# EAGLE design main (EAGLE 5.11)
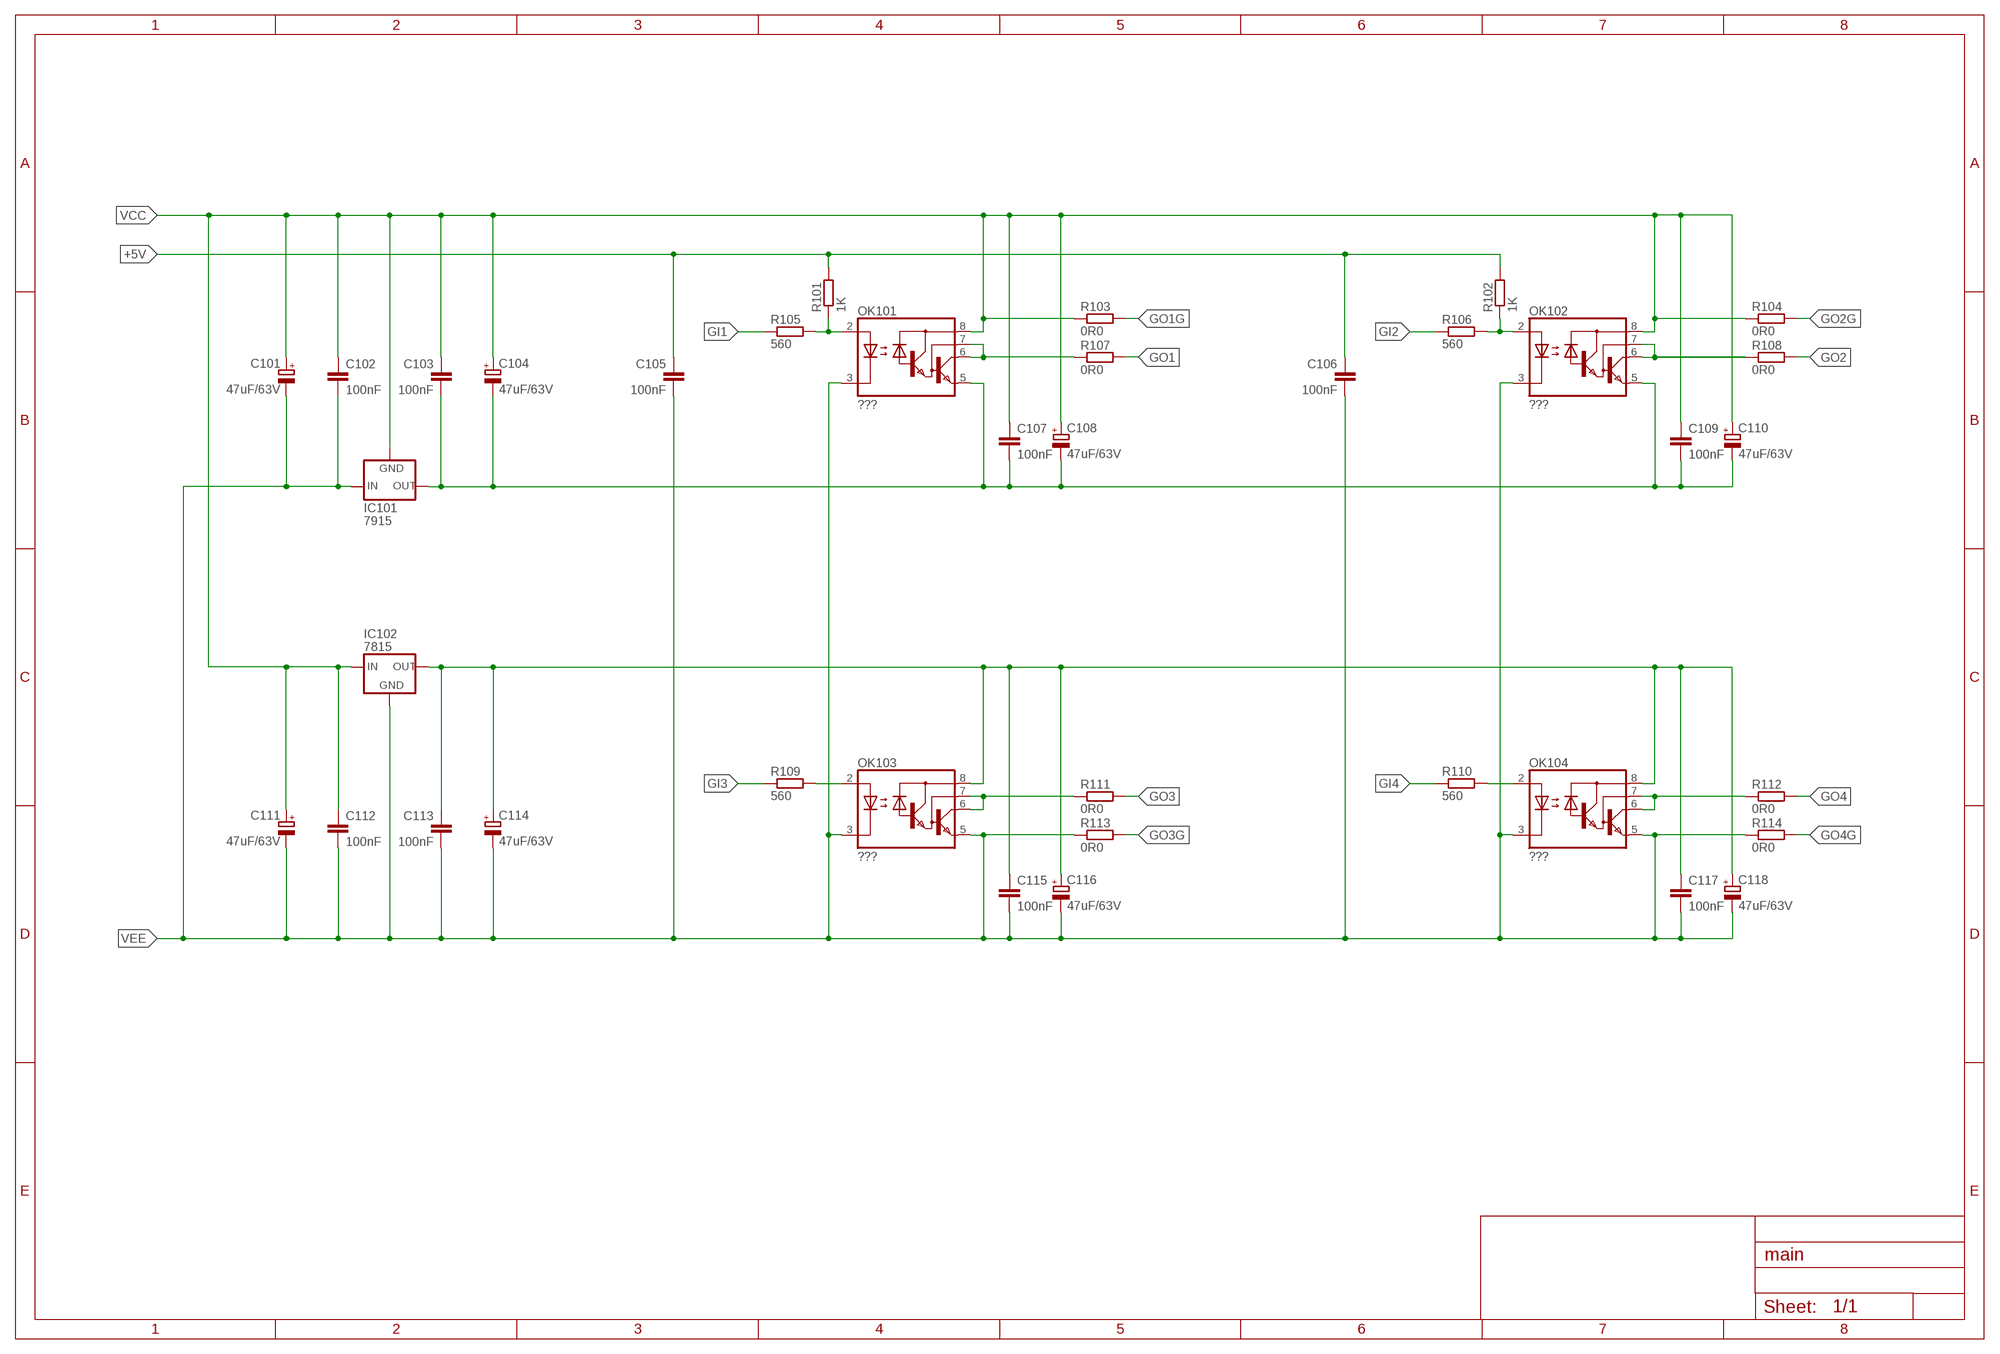
[diagram p0: schematic, sheet 1]

## Parts
C101  47uF/63V  CPOL-EUE2.5-5  [E2,5-5]
C102  100nF  C-EU050-025X075  [C050-025X075]
C103  100nF  C-EU050-025X075  [C050-025X075]
C104  47uF/63V  CPOL-EUE2.5-5  [E2,5-5]
C105  100nF  C-EU025-024X044  [C025-024X044]
C106  100nF  C-EU025-024X044  [C025-024X044]
C107  100nF  C-EU050-025X075  [C050-025X075]
C108  47uF/63V  CPOL-EUE2.5-5  [E2,5-5]
C109  100nF  C-EU050-025X075  [C050-025X075]
C110  47uF/63V  CPOL-EUE2.5-5  [E2,5-5]
C111  47uF/63V  CPOL-EUE2.5-5  [E2,5-5]
C112  100nF  C-EU050-025X075  [C050-025X075]
C113  100nF  C-EU050-025X075  [C050-025X075]
C114  47uF/63V  CPOL-EUE2.5-5  [E2,5-5]
C115  100nF  C-EU050-025X075  [C050-025X075]
C116  47uF/63V  CPOL-EUE2.5-5  [E2,5-5]
C117  100nF  C-EU050-025X075  [C050-025X075]
C118  47uF/63V  CPOL-EUE2.5-5  [E2,5-5]
IC101  7915  79XXS  [79XXS]
IC102  7815  78XXS  [78XXS]
OK101  ???  6N138  [DIL08]
OK102  ???  6N138  [DIL08]
OK103  ???  6N138  [DIL08]
OK104  ???  6N138  [DIL08]
R101  1K  R-EU_0207/7  [0207/7]
R102  1K  R-EU_0207/7  [0207/7]
R103  0R0  R-EU_0207/7  [0207/7]
R104  0R0  R-EU_0207/7  [0207/7]
R105  560  R-EU_0207/7  [0207/7]
R106  560  R-EU_0207/7  [0207/7]
R107  0R0  R-EU_0207/7  [0207/7]
R108  0R0  R-EU_0207/7  [0207/7]
R109  560  R-EU_0207/7  [0207/7]
R110  560  R-EU_0207/7  [0207/7]
R111  0R0  R-EU_0207/7  [0207/7]
R112  0R0  R-EU_0207/7  [0207/7]
R113  0R0  R-EU_0207/7  [0207/7]
R114  0R0  R-EU_0207/7  [0207/7]

## Nets
+5V: C105.1 C106.1 R101.2 R102.2
GI1: R105.1
GI2: R106.1
GI3: R109.1
GI4: R110.1
GO1: R107.2
GO1G: R103.2
GO2: R108.2
GO2G: R104.2
GO3: R111.2
GO3G: R113.2
GO4: R112.2
GO4G: R114.2
N$1: OK103.6(VO) OK103.7(VB) R111.1
N$2: OK104.2(A) R110.2
N$3: OK103.2(A) R109.2
N$4: C113.1 C114.+ C115.1 C116.+ C117.1 C118.+ IC102.OUT OK103.8(VCC) OK104.8(VCC)
N$5: OK101.2(A) R101.1 R105.2
N$6: C103.2 C104.- C107.2 C108.- C109.2 C110.- IC101.OUT OK101.5(GND) OK102.5(GND)
N$8: OK102.6(VO) OK102.7(VB) R108.1
N$13: OK104.6(VO) OK104.7(VB) R112.1
N$15: OK102.2(A) R102.1 R106.2
N$17: OK101.6(VO) OK101.7(VB) R107.1
VCC: C101.+ C102.1 C103.1 C104.+ C107.1 C108.+ C109.1 C110.+ C111.+ C112.1 IC101.GND IC102.IN OK101.8(VCC) OK102.8(VCC) R103.1 R104.1
VEE: C101.- C102.2 C105.2 C106.2 C111.- C112.2 C113.2 C114.- C115.2 C116.- C117.2 C118.- IC101.IN IC102.GND OK101.3(C) OK102.3(C) OK103.3(C) OK103.5(GND) OK104.3(C) OK104.5(GND) R113.1 R114.1

## Library data of the parts
C101 C104 C108 C110 C111 C114 C116 C118 = rcl:CPOL-EU: POLARIZED CAPACITOR, European symbol
C102 C103 C105-C107 C109 C112 C113 C115 C117 = rcl:C-EU: CAPACITOR, European symbol
IC101 = v-reg:79XXS: VOLTAGE REGULATOR
IC102 = v-reg:78XXS: VOLTAGE REGULATOR
OK101-OK104 = optocoupler:6N138: MOTOROLA OPTO COUPLER; MF: VISHAY/TELEFUNKEN; MPN: 6N138; OC_FARNELL: 9860150; OC_NEWARK: 35K5294
R101-R114 = rcl:R-EU_: RESISTOR, European symbol

## Board
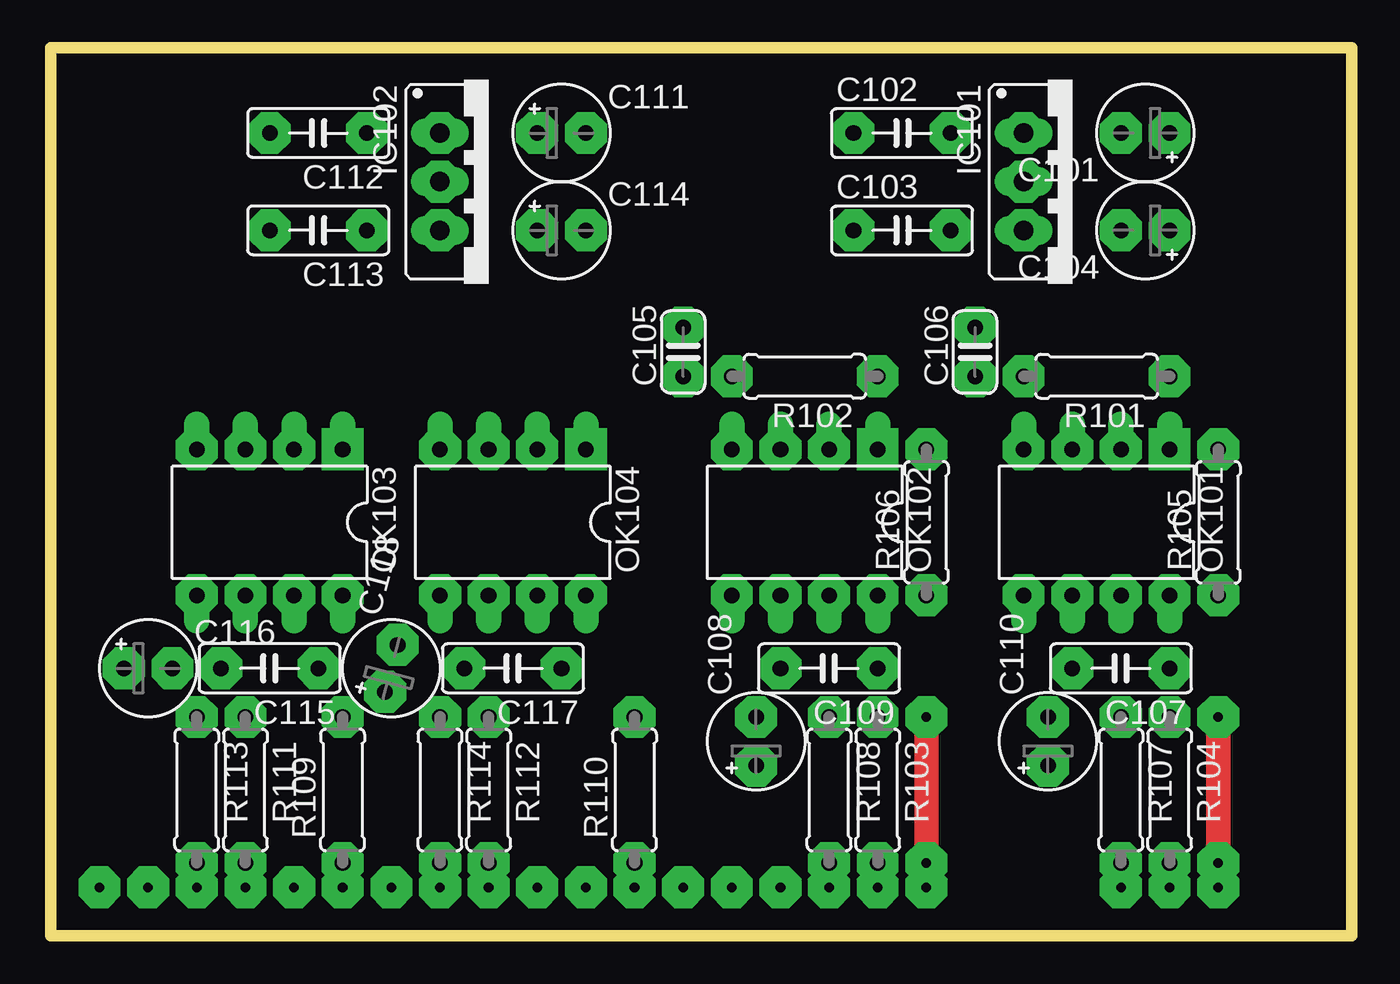
[diagram p1: board, top side]
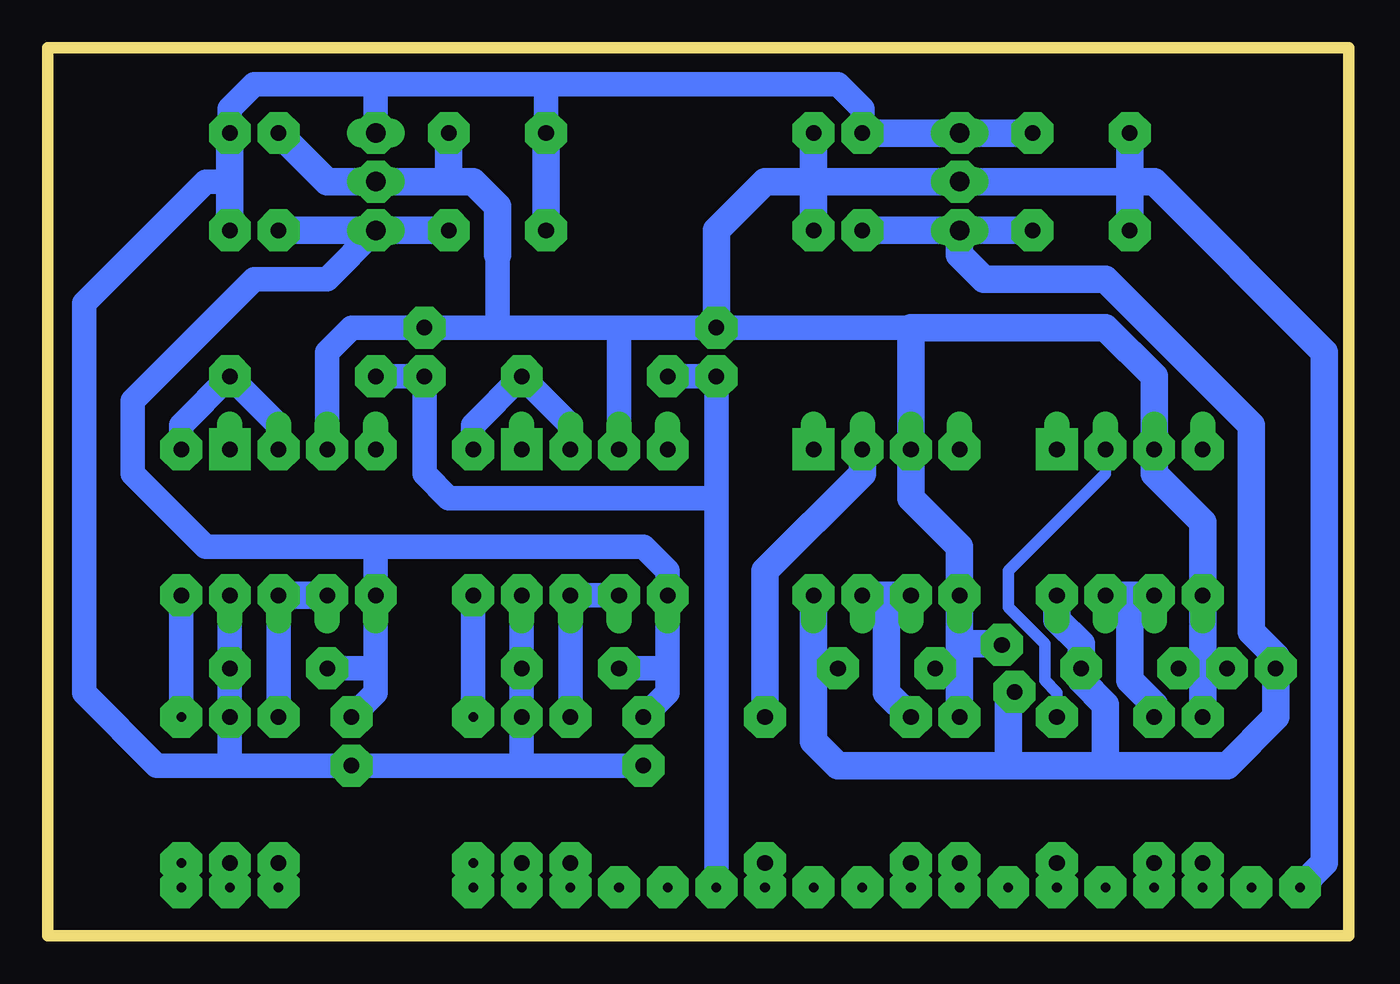
[diagram p2: board, bottom side, seen from below]

Size 67.92 x 46.35 mm. Coordinates in mm from the lower left corner, seen from the top.
Outline: 0,0 67.92,0 67.92,46.35 0,46.35 0,0
Copper layers (1*16): Top 0.035mm / dielectric 1.5mm / Bottom 0.035mm
Design rules "default": minimum track width 10mil, minimum drill 24mil, track to track 8mil, track to pad 8mil, pad to pad 8mil, via to via 8mil, smd to smd 8mil, copper to edge 40mil, drill to drill 8mil, minimum pad ring 10mil, minimum via ring 8mil, stop-mask expansion 4mil, vias tented up to drill 0mil, thermal gap 10mil

### Footprints (pad centres in the part's own frame; a part is rotated, then mirrored left to right if it is on the bottom)
E2,5-5 = drill 0.813 pad 1.6 round: + -1.27,0 | drill 0.813 pad 1.6 octagon: - 1.27,0
C050-025X075 = drill 0.813 octagon: 1 -2.54,0; 2 2.54,0
C025-024X044 = drill 0.813 octagon: 1 -1.27,0; 2 1.27,0
79XXS = drill 1.016 long: GND -2.54,-2.54; IN 0,-2.54; OUT 2.54,-2.54
78XXS = drill 1.016 long: GND 0,-2.54; IN -2.54,-2.54; OUT 2.54,-2.54
DIL08 = drill 0.813 offset: 1 -3.81,-3.81; 2 -1.27,-3.81; 3 1.27,-3.81; 4 3.81,-3.81; 5 3.81,3.81; 6 1.27,3.81; 7 -1.27,3.81; 8 -3.81,3.81
0207/7 = drill 0.813 octagon: 1 -3.81,0; 2 3.81,0

### Placement (x,y rotation side)
C101  57.15,41.91 180 top
C102  44.45,41.91 0 top
C103  44.45,36.83 0 top
C104  57.15,36.83 180 top
C105  33.02,30.48 90 top
C106  48.26,30.48 90 top
C107  55.88,13.97 180 top
C108  36.83,10.16 90 top
C109  40.64,13.97 180 top
C110  52.07,10.16 90 top
C111  26.67,41.91 0 top
C112  13.97,41.91 180 top
C113  13.97,36.83 180 top
C114  26.67,36.83 0 top
C115  11.43,13.97 180 top
C116  5.08,13.97 0 top
C117  24.13,13.97 180 top
C118  17.78,13.97 75 top
IC101  53.34,39.37 270 top
IC102  22.86,39.37 270 top
OK101  54.61,21.59 180 top
OK102  39.37,21.59 180 top
OK103  11.43,21.59 180 top
OK104  24.13,21.59 180 top
R101  54.61,29.21 180 top
R102  39.37,29.21 180 top
R103  43.18,7.62 270 top
R104  58.42,7.62 270 top
R105  60.96,21.59 90 top
R106  45.72,21.59 90 top
R107  55.88,7.62 270 top
R108  40.64,7.62 270 top
R109  15.24,7.62 90 top
R110  30.48,7.62 90 top
R111  10.16,7.62 270 top
R112  22.86,7.62 270 top
R113  7.62,7.62 270 top
R114  20.32,7.62 270 top

### Tracks (layer width: path | path; a pad name or v marks a point on that pad's centre or on a via)
+5V  (via drill 0.5 pad 2.18)
  Bottom 1.27: R102.2 C105.1 33.02,22.86 | v33.02,2.54 33.02,22.86 | R101.2 C106.1 48.26,24.13 46.99,22.86 33.02,22.86
  other vias: 33.02,29.21 35.56,29.21 50.8,29.21 48.26,29.21
GI1  (via drill 0.5 pad 2.18)
  Top 1.27: v60.96,3.81 v60.96,11.43
  Bottom 1.27: v60.96,11.43 R105.1 | v60.96,3.81 v60.96,2.54
  other vias: 60.96,17.78
GI2  (via drill 0.5 pad 2.18)
  Top 1.27: v45.72,3.81 v45.72,11.43
  Bottom 1.27: v45.72,11.43 R106.1 | v45.72,3.81 v45.72,2.54
  other vias: 45.72,17.78
GI3  (via drill 0.5 pad 2.18)
  Bottom 1.422: R109.1 v15.24,2.54
  other vias: 15.24,3.81
GI4  (via drill 0.5 pad 2.18)
  Bottom 1.422: R110.1 v30.48,2.54
  other vias: 30.48,3.81
GO1  (via drill 0.5 pad 2.18)
  Bottom 1.422: R107.2 v55.88,2.54
  other vias: 55.88,3.81
GO1G  (via drill 0.5 pad 2.18)
  Bottom 1.422: R103.2 v43.18,2.54
  other vias: 43.18,3.81
GO2  (via drill 0.5 pad 2.18)
  Bottom 1.422: R108.2 v40.64,2.54
  other vias: 40.64,3.81
GO2G  (via drill 0.5 pad 2.18)
  Bottom 1.422: R104.2 v58.42,2.54
  other vias: 58.42,3.81
GO3  (via drill 0.5 pad 2.18)
  Bottom 1.422: R111.2 v10.16,2.54
  other vias: 10.16,3.81
GO3G  (via drill 0.5 pad 2.18)
  Bottom 1.422: R113.2 v7.62,2.54
  other vias: 7.62,3.81
GO4  (via drill 0.5 pad 2.18)
  Bottom 1.422: R112.2 v22.86,2.54
  other vias: 22.86,3.81
GO4G  (via drill 0.5 pad 2.18)
  Bottom 1.422: R114.2 v20.32,2.54
  other vias: 20.32,3.81
N$1  (via drill 0.5 pad 2.18)
  Bottom 1.422: 11.43,17.78 OK103.7 | 11.43,17.78 OK103.6 | R111.1 10.16,12.06 11.43,13.34 11.43,17.78
  other vias: 10.16,17.78 12.7,17.78 10.16,11.43
N$2  (via drill 0.5 pad 2.18)
  Bottom 1.422: OK104.2 25.4,24.13 30.48,19.05 R110.2
  other vias: 30.48,11.43
N$3  (via drill 0.5 pad 2.18)
  Bottom 0.61: R109.2 15.24,12.7 15.88,13.34 15.88,15.24 17.78,17.14 17.78,19.05 12.7,24.13 OK103.2
  other vias: 12.7,25.4 15.24,11.43
N$4  (via drill 0.5 pad 2.18)
  Bottom 0.61: C118.+ 17.45,11.76 17.78,11.43
  Bottom 1.422: IC102.OUT C114.+ | IC102.OUT C113.1 | 27.94,13.97 OK104.8 | 27.94,13.97 27.94,10.16 26.67,8.89 17.78,8.89 | 27.94,13.97 C117.1 | 12.7,8.89 6.35,8.89 3.81,11.43 C116.+ 3.81,14.61 5.08,15.88 5.08,25.4 5.08,26.67 12.7,34.29 19.05,34.29 20.32,35.56 IC102.OUT | 12.7,8.89 17.78,8.89 | 17.78,8.89 17.78,11.43 17.78,12.41 C118.+ | OK103.8 15.24,16.51 13.97,15.24 C115.1 13.97,13.34 12.7,12.06 12.7,8.89
  other vias: 15.24,17.78 27.94,17.78 26.67,13.97 13.97,13.97 16.51,36.83 20.32,36.83 25.4,36.83 17.45,12.74 3.81,13.97
N$5  (via drill 0.5 pad 2.18)
  Bottom 1.27: OK101.2 55.88,26.67 R101.1 60.96,26.67 R105.2
  other vias: 58.42,29.21 55.88,25.4 60.96,25.4
N$6  (via drill 0.5 pad 2.18)
  Bottom 1.27: 50.8,13.97 C107.2 | 50.8,13.97 OK101.5 50.8,20.32 | 35.56,13.97 C109.2 | 35.56,13.97 OK102.5 35.56,19.05 36.83,20.32 50.8,20.32 | 50.8,20.32 59.69,20.32 63.5,24.13 63.5,27.94 57.15,34.29 53.34,34.29 IC101.OUT | C108.- 35.56,12.7 35.56,13.97 | C110.- 50.8,12.7 50.8,13.97
  Bottom 1.422: C104.- IC101.OUT C103.2
  other vias: 35.56,17.78 50.8,17.78 53.34,13.97 38.1,13.97 50.8,36.83 55.88,36.83 46.99,36.83 36.83,11.43 52.07,11.43
N$7  (via drill 0.5 pad 2.18)
  other vias: 17.78,2.54
N$8  (via drill 0.5 pad 2.18)
  Bottom 1.27: R108.1 OK102.7 OK102.6
  other vias: 38.1,17.78 40.64,11.43 40.64,17.78
N$9  (via drill 0.5 pad 2.18)
  other vias: 12.7,2.54
N$10  (via drill 0.5 pad 2.18)
  other vias: 5.08,2.54
N$11  (via drill 0.5 pad 2.18)
  other vias: 25.4,2.54
N$12  (via drill 0.5 pad 2.18)
  other vias: 27.94,2.54
N$13  (via drill 0.5 pad 2.18)
  Bottom 1.422: R112.1 24.13,12.7 24.13,17.78 OK104.7 OK104.6
  other vias: 22.86,17.78 25.4,17.78 22.86,11.43
N$14  (via drill 0.5 pad 2.18)
  other vias: 35.56,2.54
N$15  (via drill 0.5 pad 2.18)
  Bottom 1.27: OK102.2 40.64,26.67 R102.1 45.72,26.67 R106.2
  other vias: 43.18,29.21 40.64,25.4 45.72,25.4
N$16  (via drill 0.5 pad 2.18)
  other vias: 38.1,2.54
N$17  (via drill 0.5 pad 2.18)
  Bottom 1.27: R107.1 OK101.7
  Bottom 1.422: OK101.7 OK101.6
  other vias: 53.34,17.78 55.88,17.78 55.88,11.43
N$18  (via drill 0.5 pad 2.18)
  other vias: 35.56,25.4
N$27  (via drill 0.5 pad 2.18)
  other vias: 25.4,25.4
N$28  (via drill 0.5 pad 2.18)
  other vias: 7.62,25.4
N$29  (via drill 0.5 pad 2.18)
  other vias: 15.24,25.4
N$30  (via drill 0.5 pad 2.18)
  other vias: 27.94,25.4
N$31  (via drill 0.5 pad 2.18)
  other vias: 20.32,25.4
N$32  (via drill 0.5 pad 2.18)
  other vias: 38.1,25.4
N$33  (via drill 0.5 pad 2.18)
  other vias: 43.18,25.4
N$34  (via drill 0.5 pad 2.18)
  other vias: 50.8,25.4
N$35  (via drill 0.5 pad 2.18)
  other vias: 58.42,25.4
VCC  (via drill 0.5 pad 2.18)
  Bottom 1.27: R103.1 C109.1 OK102.8 R103.1 | OK101.8 C107.1 R104.1 58.42,8.89 | 58.42,39.37 59.69,39.37 66.04,33.02 66.04,12.7 62.23,8.89 58.42,8.89 | C108.+ 43.18,8.89 | 43.18,8.89 C110.+ 58.42,8.89 | 43.18,8.89 R103.1 | C111.+ 25.4,43.18 26.67,44.45 41.91,44.45 | 41.91,44.45 C102.1 | 50.8,44.45 41.91,44.45 | 50.8,44.45 IC101.GND | 50.8,44.45 57.15,44.45 58.42,43.18 C101.+
  Bottom 1.422: C102.1 C103.1 | C104.+ 58.42,39.37 C101.+ | C112.1 IC102.IN C111.+
  other vias: 43.18,17.78 58.42,17.78 43.18,13.97 58.42,13.97 43.18,11.43 58.42,11.43 16.51,41.91 20.32,41.91 25.4,41.91 41.91,36.83 41.91,41.91 50.8,41.91 58.42,36.83 58.42,41.91 36.83,8.89 52.07,8.89
VEE  (via drill 0.5 pad 2.18)
  Bottom 0.61: 7.62,13.97 C116.-
  Bottom 1.27: 38.1,31.75 OK102.3 | OK101.3 53.34,30.48 52.07,31.75 C106.2 44.45,31.75 | 38.1,31.75 44.45,31.75 | 44.45,31.75 44.45,35.56 | 7.62,21.59 R113.1 | 10.16,29.21 10.16,24.13 | 22.86,31.75 C105.2 38.1,31.75
  Bottom 1.422: C101.- 53.34,39.37 IC101.IN 46.99,39.37 | 27.94,39.37 C114.- | 27.94,39.37 IC102.GND 11.43,39.37 | 11.43,39.37 C112.2 | 11.43,39.37 C113.2 | 27.94,39.37 C111.- | 27.94,39.37 30.48,39.37 33.02,36.83 C105.2 | 20.32,15.24 OK104.5 20.32,20.32 22.86,22.86 OK104.3 22.86,31.75 12.7,31.75 10.16,29.21 OK103.3 10.16,24.13 7.62,21.59 OK103.5 7.62,13.97 | 20.32,15.24 20.32,13.97 | 20.32,13.97 C117.2 | 7.62,13.97 C115.2 | R113.1 7.62,13.97 | 20.32,13.97 R114.1 | 44.45,35.56 44.45,38.1 45.72,39.37 46.99,39.37 | 46.99,39.37 C102.2 | v2.54,2.54 1.27,3.81 1.27,30.48 10.16,39.37 11.43,39.37 | 20.32,15.24 18.41,15.24 C118.-
  other vias: 7.62,17.78 20.32,17.78 22.86,25.4 10.16,25.4 21.59,13.97 8.89,13.97 7.62,11.43 20.32,11.43 11.43,36.83 11.43,41.91 20.32,39.37 27.94,36.83 27.94,41.91 50.8,39.37 55.88,41.91 46.99,41.91 18.11,15.2 6.35,13.97 53.34,25.4 33.02,31.75 48.26,31.75